# Altium schematic sheet HYDRA_V3_BEACON.SchDoc
size B; SheetNumber: 1; SheetTotal: 7
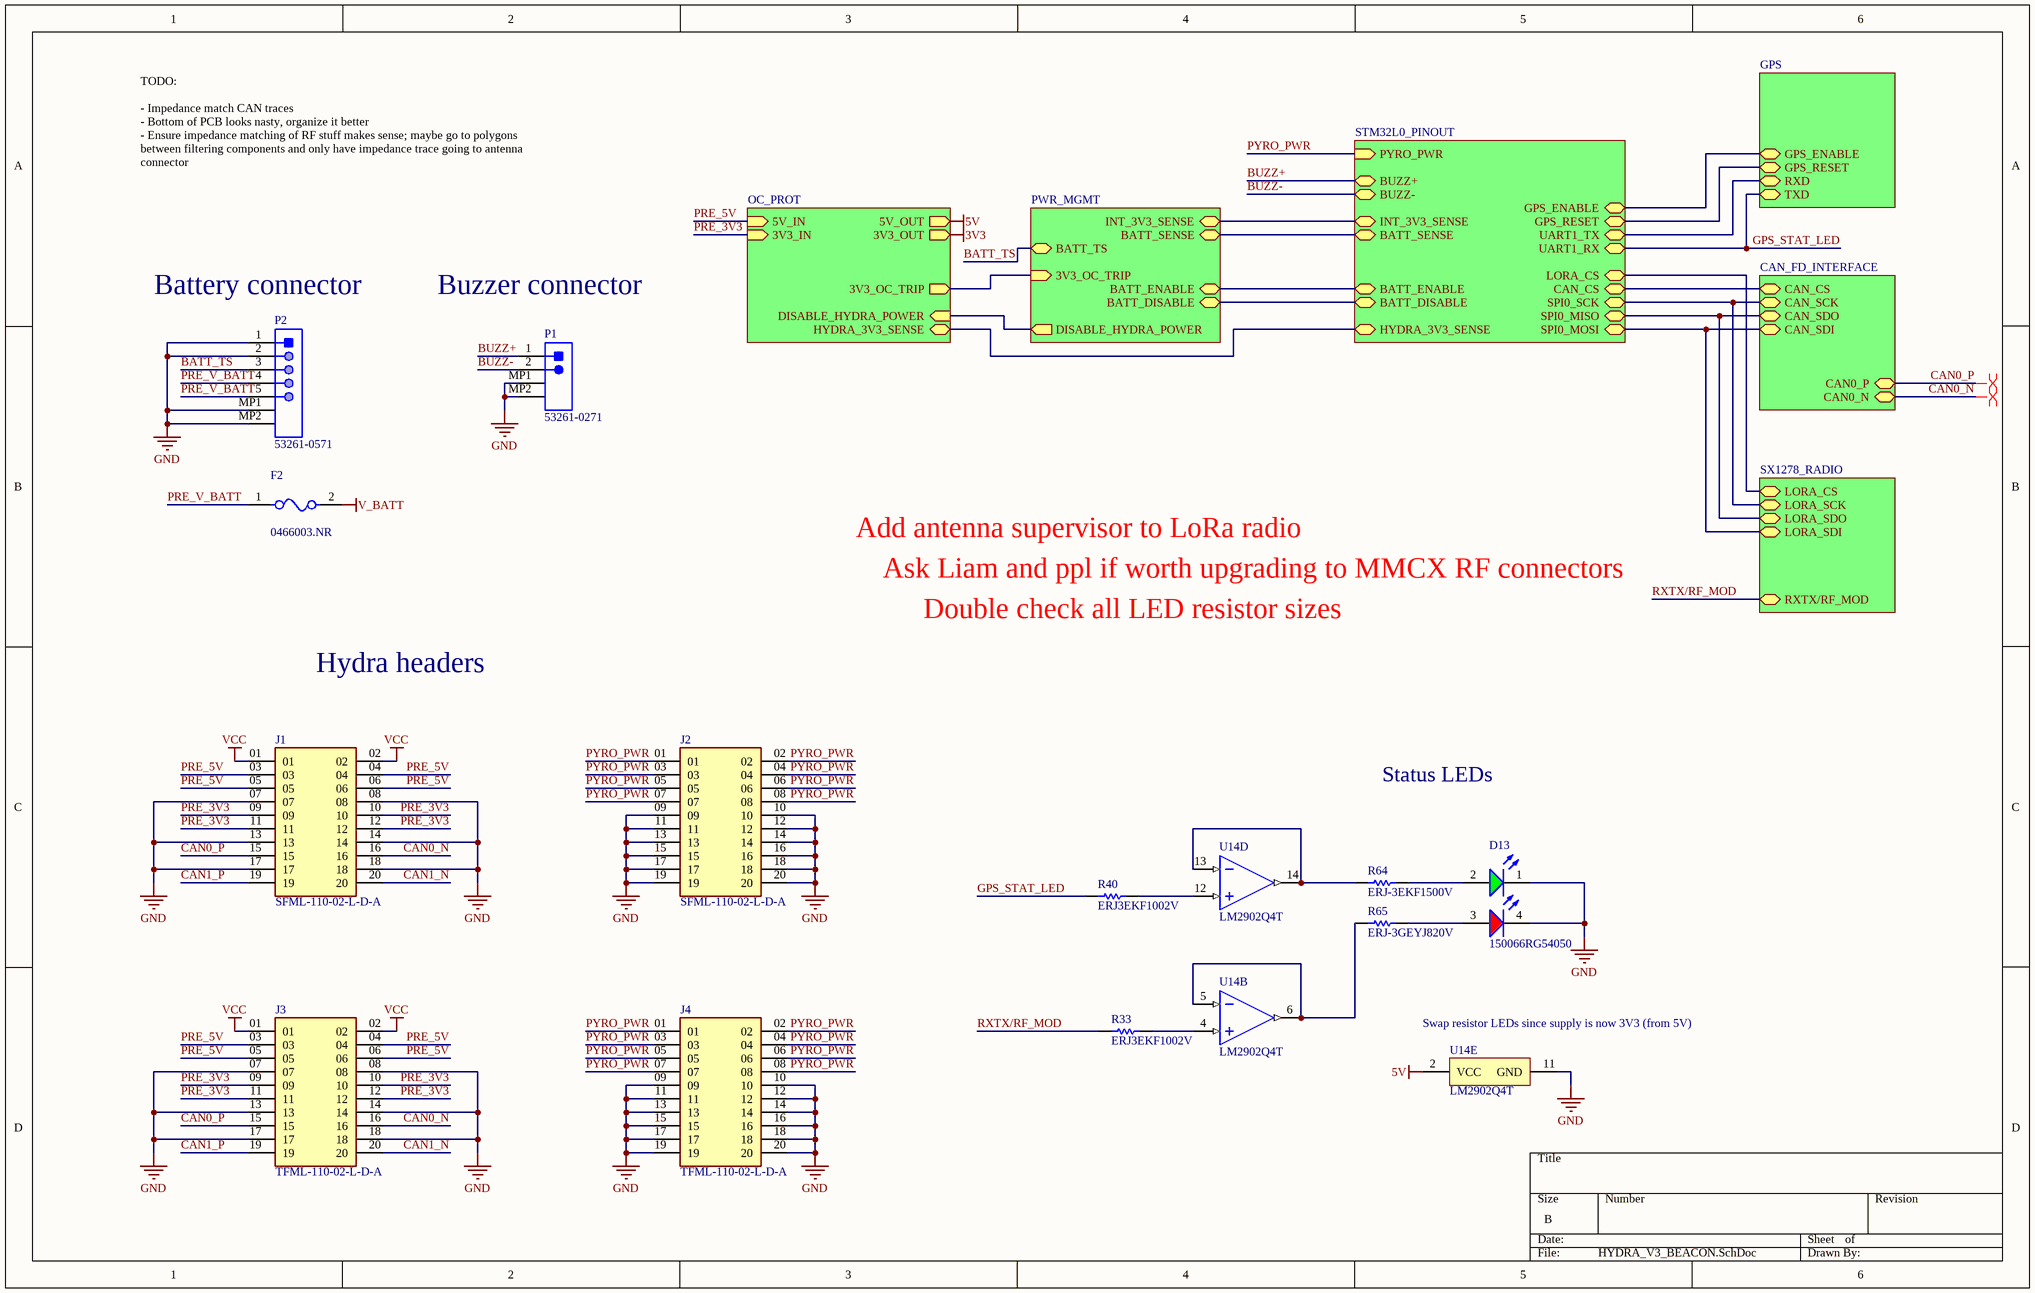
[diagram p0: HYDRA_V3_BEACON.SchDoc]

## Parts
D13  150066RG54050  [WL-SBCD_0606]
F2  0466003.NR  [FP-0466-MFG]
J1  SFML-110-02-L-D-A  [SFML-110-02-L-D-A-Footprint-1]
J2  SFML-110-02-L-D-A  [SFML-110-02-L-D-A-Footprint-1]
J3  TFML-110-02-L-D-A  [TFML-110-02-L-D-A-Footprint-1]
J4  TFML-110-02-L-D-A  [TFML-110-02-L-D-A-Footprint-1]
P1  53261-0271  [MOLX-53261-0271_V]
P2  53261-0571  [MOLX-52361-0571-5_V]
R33  ERJ3EKF1002V  [RESC1609X55X30LL15T15]
R40  ERJ3EKF1002V  [RESC1609X55X30LL15T15]
R64  ERJ-3EKF1500V  [RESC1608X55X30NL15T15]
R65  ERJ-3GEYJ820V  [RESC1608X55X30NL15T15]
U14  LM2902Q4T  [LM2902Q4T-Footprint-1]  (parts B,D,E of 5)

## Sub-sheets
CAN_FD = CAN_FD_INTERFACE: CAN0_P (bidir), CAN0_N (bidir), CAN_SCK (bidir), CAN_SDI (bidir), CAN_SDO (bidir), CAN_CS (bidir)
GPS = GPS: TXD (bidir), RXD (bidir), GPS_ENABLE (bidir), GPS_RESET (bidir)
MCU_PINOUT = STM32L0_PINOUT: PYRO_PWR (in), LORA_CS (bidir), CAN_CS (bidir), SPI0_SCK (bidir), SPI0_MISO (bidir), SPI0_MOSI (bidir), UART1_TX (bidir), UART1_RX (bidir), GPS_ENABLE (bidir), GPS_RESET (bidir), INT_3V3_SENSE (bidir), BATT_SENSE (bidir), BATT_ENABLE (bidir), BATT_DISABLE (bidir), BUZZ+ (bidir), BUZZ- (bidir), HYDRA_3V3_SENSE (bidir)
OC_PROT = OC_PROT: 5V_OUT (out), 5V_IN (in), 3V3_IN (in), 3V3_OUT (out), DISABLE_HYDRA_POWER (in), HYDRA_3V3_SENSE (bidir), 3V3_OC_TRIP (out)
PWR_MGMT = PWR_MGMT: BATT_ENABLE (bidir), BATT_DISABLE (bidir), INT_3V3_SENSE (bidir), BATT_SENSE (bidir), BATT_TS (bidir), DISABLE_HYDRA_POWER (out), 3V3_OC_TRIP (in)
RADIO = SX1278_RADIO: LORA_SCK (bidir), LORA_SDI (bidir), LORA_SDO (bidir), LORA_CS (bidir), RXTX/RF_MOD (bidir)

## Nets
3V3: sheet OC_PROT/3V3_OUT
5V: U14.2(VCC) ; sheet OC_PROT/5V_OUT
GND: D13.1(K) D13.4(K) J1.07 J1.08 J1.13 J1.14 J1.17 J1.18 J2.09 J2.10 J2.11 J2.12 J2.13 J2.14 J2.15 J2.16 J2.17 J2.18 J2.19 J2.20 J3.07 J3.08 J3.13 J3.14 J3.17 J3.18 J4.09 J4.10 J4.11 J4.12 J4.13 J4.14 J4.15 J4.16 J4.17 J4.18 J4.19 J4.20 P1.MP1 P1.MP2 P2.1 P2.2 P2.MP1 P2.MP2 U14.11(GND)
V_BATT: F2.2
VCC: J1.01 J1.02 J3.01 J3.02
BATT_TS: P2.3 ; sheet PWR_MGMT/BATT_TS
BUZZ+: P1.1 ; sheet MCU_PINOUT/BUZZ+
BUZZ-: P1.2 ; sheet MCU_PINOUT/BUZZ-
CAN0_N: J1.16 J3.16 ; sheet CAN_FD/CAN0_N
CAN0_P: J1.15 J3.15 ; sheet CAN_FD/CAN0_P
CAN1_N: J1.20 J3.20
CAN1_P: J1.19 J3.19
GPS_STAT_LED: R40.1 ; sheet MCU_PINOUT/UART1_RX, sheet GPS/TXD
PRE_3V3: J1.09 J1.10 J1.11 J1.12 J3.09 J3.10 J3.11 J3.12 ; sheet OC_PROT/3V3_IN
PRE_5V: J1.03 J1.04 J1.05 J1.06 J3.03 J3.04 J3.05 J3.06 ; sheet OC_PROT/5V_IN
PRE_V_BATT: F2.1 P2.4 P2.5
PYRO_PWR: J2.01 J2.02 J2.03 J2.04 J2.05 J2.06 J2.07 J2.08 J4.01 J4.02 J4.03 J4.04 J4.05 J4.06 J4.07 J4.08 ; sheet MCU_PINOUT/PYRO_PWR
RXTX/RF_MOD: R33.2 ; sheet RADIO/RXTX/RF_MOD
NetD13_2: D13.2(A) R64.2
NetD13_3: D13.3(A) R65.2
NetR33_1: R33.1 U14.4(2IN+)
NetR40_2: R40.2 U14.12(4IN+)
NetR64_1: R64.1 U14.13(4IN-) U14.14(4OUT)
NetR65_1: R65.1 U14.5(2IN-) U14.6(2OUT)
(unnamed): sheet OC_PROT/DISABLE_HYDRA_POWER, sheet PWR_MGMT/DISABLE_HYDRA_POWER
(unnamed): sheet OC_PROT/HYDRA_3V3_SENSE, sheet MCU_PINOUT/HYDRA_3V3_SENSE
(unnamed): sheet OC_PROT/3V3_OC_TRIP, sheet PWR_MGMT/3V3_OC_TRIP
(unnamed): sheet MCU_PINOUT/LORA_CS, sheet RADIO/LORA_CS
(unnamed): sheet MCU_PINOUT/CAN_CS, sheet CAN_FD/CAN_CS
(unnamed): sheet MCU_PINOUT/SPI0_SCK, sheet CAN_FD/CAN_SCK, sheet RADIO/LORA_SCK
(unnamed): sheet MCU_PINOUT/SPI0_MISO, sheet CAN_FD/CAN_SDO, sheet RADIO/LORA_SDO
(unnamed): sheet MCU_PINOUT/SPI0_MOSI, sheet CAN_FD/CAN_SDI, sheet RADIO/LORA_SDI
(unnamed): sheet MCU_PINOUT/UART1_TX, sheet GPS/RXD
(unnamed): sheet MCU_PINOUT/GPS_ENABLE, sheet GPS/GPS_ENABLE
(unnamed): sheet MCU_PINOUT/GPS_RESET, sheet GPS/GPS_RESET
(unnamed): sheet MCU_PINOUT/INT_3V3_SENSE, sheet PWR_MGMT/INT_3V3_SENSE
(unnamed): sheet MCU_PINOUT/BATT_SENSE, sheet PWR_MGMT/BATT_SENSE
(unnamed): sheet MCU_PINOUT/BATT_ENABLE, sheet PWR_MGMT/BATT_ENABLE
(unnamed): sheet MCU_PINOUT/BATT_DISABLE, sheet PWR_MGMT/BATT_DISABLE

## Layout directives
differential pair: CAN0_N, CAN0_P

## Notes on the sheet
- TODO:
  - Impedance match CAN traces
  - Bottom of PCB looks nasty, organize it better
  - Ensure impedance matching of RF stuff makes sense; maybe go to polygons between filtering components and only have impedance trace going to antenna connector
- (near P2) Battery connector
- Buzzer connector
- Add antenna supervisor to LoRa radio
- Ask Liam and ppl if worth upgrading to MMCX RF connectors
- Double check all LED resistor sizes
- Hydra headers
- Status LEDs
- (near U14) Swap resistor LEDs since supply is now 3V3 (from 5V)

## Library data of the parts
D13 = CMP-004-00034-2: Led, Red/Grn, 180Mcd/230Mcd, 624Nm/525Nm Rohs Compliant: Yes
F2 = CMP-08605-000054-1: FUSE BOARD MNT 3A 32VAC/VDC 1206; Manufacturer: Littelfuse; Fuse Interrupt Ac Current: 50A; Fuse Voltage Drop: 75.99mV; Max Fuse Ac Voltage: 32V; Fuse I2T: 0.576A2Sec; Resistance: 0.019Ω; Fuse Blow Speed: Fast; Value: 0.019Ω; ComponentLink2Description: Datasheet; Fuse Current: 3A; RoHS: TRUE; Mouser Description: Surface Mount Fuses 32V 3A VFA Slimline; Height: 0.66mm; Octopart: https://octopart.com/0466003.nr-littelfuse-565175; Package: 0466; Fuse Interrupt Dc Current: 50A; Manufacturer Part Number: 0466003.NR; Temperature Range Low: -55°C; ComponentLink2URL: https://www.littelfuse.com/~/media/electronics/datasheets/fuses/littelfuse_fuse_466_datasheet.pdf.pdf; Digikey Description: FUSE BOARD MNT 3A 32VAC/VDC 1206; Voltage Rating: 32V; Category: Fuse; Lead Free: Yes; Device Class L2: Fuses; Automotive: No; Max Fuse Dc Voltage: 32V; Temperature Range High: +90°C; Device Class L3: unset; Device Class L1: Circuit Protection; Temperature: -55°C to +90°C
J1 J2 = CMP-002-00076-2: Headers & Wire Housings .050 Tiger Eye High-Reliability Locking Socket Strip
J3 J4 = CMP-002-00077-1: Conn Shrouded Header (4 Sides) HDR 20 POS 1.27mm Solder ST Top Entry SMD TIGER EYE™ Tube
P1 = CMP-2000-05633-1: PicoBlade(TM) Header, Right Angle, -40 to 85 degC, 2-Pin SMD, RoHS, Tape and Reel; Current - Max: 1A; Brand: Molex; Voltage Rating: 125V; Number of Positions: 2; Pitch: 1.25mm; Package Version: Rev. H, 11/2014; Factory Pack Quantity: 1000; Datasheet URL: http://www.molex.com/webdocs/datasheets/pdf/en-us/0532610271_PCB_HEADERS.pdf; Datasheet Version: 03/2016; Housing Material: Thermoplastic; RoHS: Details; Product Type: Headers; Number of Rows: 1; Termination Style: SMD; Mounting Technology: SurfaceMount; Number of Positions / Contacts: 2; Package URL: http://www.molex.com/pdm_docs/sd/532610271_sd.pdf; Mounting Angle: Right; Mounting Style: SMD/SMT; Manufacturer: Molex; Product Category: 1.25mmConnectors; Tradename: PicoBlade; Voltage - Max: 125V; Manufacturer URL: http://www.molex.com/; Series: 53261; Package Description: 2-Leads Header, Pitch 1.25 mm, Mated Height 3.4 mm; Package Reference: 53261-0271; Current Rating: 1A; Contact Plating: Tin; Contact Material: PhosphorBronze; Type: Shrouded; Packaging: Reel
P2 = CMP-2000-05249-1: Male Header, Pitch 1.25 mm, 1 x 5 Position, Height 3.4 mm, RoHS, Tape and Reel; Brand: Molex; Mounting Angle: Right; Number of Positions: 5; Voltage Rating: 125V; Current Rating: 1A; Pitch: 1.25mm; Datasheet Version: Rev. D, 04/2004; Housing Material: Thermoplastic; Series: 53261; RoHS: Details; Product Category: Headers&WireHousings; Datasheet URL: http://datasheet.octopart.com/532610571-Molex-datasheet-8343080.pdf; Manufacturer URL: http://www.molex.com/; Contact Material: PhosphorBronze; Tradename: PicoBlade; Number of Rows: 1; Product Type: Headers; Manufacturer: Molex; Type: Shrouded; Termination Style: SMD; Mounting Style: SMD/SMT; Factory Pack Quantity: 1000; Contact Plating: Tin; Packaging: Reel; Number of Positions / Contacts: 5
R33 R40 = CMP-1012-00623-3: Chip Resistor, 10 KOhm, +/- 1%, 0.1 W, -55 to 155 degC, 0603 (1608 Metric), RoHS, Tape and Reel; Manufacturer: Panasonic; Voltage Rating: 75V; Case\/Package: 0603; Power Rating: 100mW; Resistance: 10KOhm; Temperature Coefficient: 100ppm\/degreesC; Number of Pins: 2; Package Reference: 603; Depth: 0.8mm; Mount: SurfaceMount; Package Description: 2-Pin Surface Mount Device, Body 1.6 x 0.85 mm; Datasheet Version: 02/2017; Length: 1.6mm; Lead Free: LeadFree; Height: 0.45mm; Number of Terminations: 2; Max Power Dissipation: 100mW; Min Operating Temperature: -55degC; Datasheet URL: https://industrial.panasonic.com/cdbs/www-data/pdf/RDA0000/AOA0000C304.pdf; Termination: SMD/SMT; Case Code (Metric): 1608; Case Code (Imperial): 0603; Tolerance: 1%; Max Operating Temperature: 155degC; RoHSCompliant: true; Voltage Rating (DC): 75V; Radiation Hardening: No; Packaging: TapeandReel; Composition: ThickFilm; Mounting Technology: SurfaceMount; Manufacturer URL: http://www.panasonic.com/; Width: 0.031inch; REACH SVHC: NoSVHC; Contact Plating: Tin; Military Standard: Not; Package Quantity: 1
R64 = CMP-2000-00256-1: Manufacturer: Panasonic; Part Number: ERJ-3EKF1500V
R65 = CMP-1012-00048-2: Manufacturer: Panasonic; Part Number: ERJ-3GEYJ820V
U14 = CMP-014-00004-1: LM2902 Series 30 V 1.3 MHz Low-Power Quad Operational Amplifier - QFN-16 (3x3)